# EAGLE design CadenceSense2.0 (EAGLE 7.2.0)
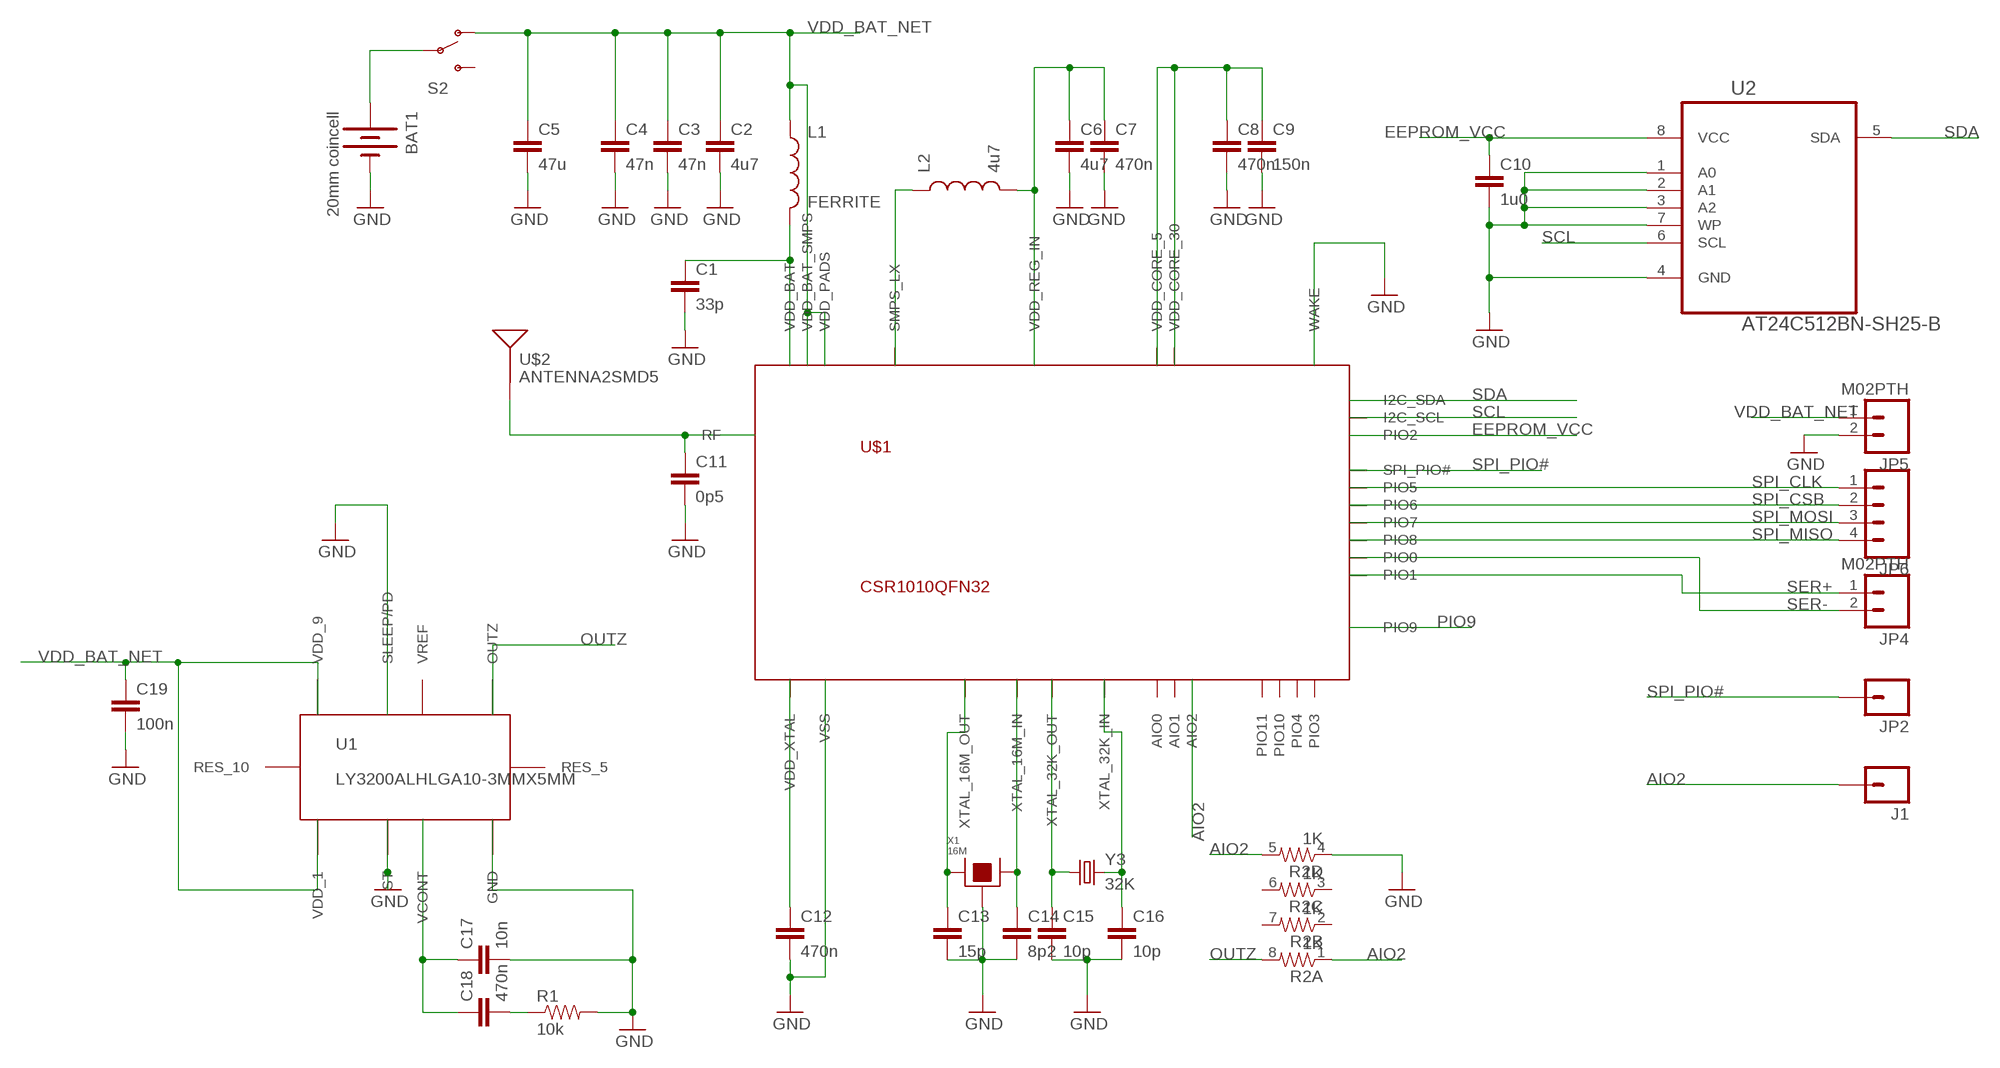
[diagram p0: schematic, sheet 1]

## Parts
BAT1  20mm coincell  BATTERY20MM_4LEGS  [BATTCON_20MM_4LEGS]
C1  33p  CAP0603-CAP  [0603-CAP]
C2  4u7  CAP0603-CAP  [0603-CAP]
C3  47n  CAP0603-CAP  [0603-CAP]
C4  47n  CAP0603-CAP  [0603-CAP]
C5  47u  CAP0603-CAP  [0603-CAP]
C6  4u7  CAP0603-CAP  [0603-CAP]
C7  470n  CAP0603-CAP  [0603-CAP]
C8  470n  CAP0603-CAP  [0603-CAP]
C9  150n  CAP0603-CAP  [0603-CAP]
C10  1u0  CAP0603-CAP  [0603-CAP]
C11  0p5  CAP0603-CAP  [0603-CAP]
C12  470n  CAP0603-CAP  [0603-CAP]
C13  15p  CAP0603-CAP  [0603-CAP]
C14  8p2  CAP0603-CAP  [0603-CAP]
C15  10p  CAP0603-CAP  [0603-CAP]
C16  10p  CAP0603-CAP  [0603-CAP]
C17  10n  CAP0603-CAP  [0603-CAP]
C18  470n  CAP0603-CAP  [0603-CAP]
C19  100n  CAP0603-CAP  [0603-CAP]
J1  M01PTH  [1X01]
JP2  M01PTH  [1X01]
JP4  M02PTH  [1X02]
JP5  M02PTH  [1X02]
JP6  M04PTH  [1X04]
L1  FERRITE  INDUCTOR0805  [0805]
L2  4u7  INDUCTOR0805  [0805]
R1  10k  RESISTOR0603-RES  [0603-RES]
R2  1K  RESISTOR-ARRAY0603-ARV  [0603-ARV]
S2  SWITCH-SPDTSMD  [AYZ0202]
U1  LY3200ALHLGA10-3MMX5MM  [LGA10]
U2  AT24C512BN-SH25-B  [SOIC127P600X175-8N]
U$1  CSR1010QFN32  [QFN-32]
U$2  ANTENNA2SMD5  [ANTENNA-CHIP5]
X1  16M  SHIELDED_CRYSTAL_TSX-3225  [TSX-3225]
Y3  32K  CRYSTALEPSONMC146  [CRYSTAL-32KHZ-SMD_EPSON_MC146]

## Nets
AIO2: J1.1 R2.1 R2.5 U$1.11(AIO2)
EEPROM_VCC: C10.1 U2.8(VCC) U$1.27(PIO2)
GND: BAT1.2(-) C1.2 C2.2 C3.2 C4.2 C5.2 C6.2 C7.2 C8.2 C9.2 C10.2 C11.2 C12.2 C13.2 C14.2 C15.2 C16.2 C17.2 C19.2 JP5.2 R1.2 R2.4 U1.2(ST) U1.4(GND) U1.8(SLEEP/PD) U2.1(A0) U2.2(A1) U2.3(A2) U2.4(GND) U2.7(WP) U$1.4(WAKE) U$1.EP(VSS) X1.2 X1.4
N$1: BAT1.1(+) S2.2(P)
N$2: C6.1 C7.1 L2.2 U$1.6(VDD_REG_IN)
N$3: C1.1 L1.2 U$1.1(VDD_BAT)
N$4: C11.1 U$1.7(RF) U$2.FEED(SIGNAL)
N$5: C16.1 U$1.3(XTAL_32K_IN) Y3.P$1
N$6: L2.1 U$1.31(SMPS_LX)
N$7: C8.1 C9.1 U$1.5(VDD_CORE_5) U$1.30(VDD_CORE_30)
N$8: C15.1 U$1.2(XTAL_32K_OUT) Y3.P$2
N$9: C14.1 U$1.10(XTAL_16M_IN) X1.3
N$12: C13.1 U$1.9(XTAL_16M_OUT) X1.1
N$13: C12.1 U$1.8(VDD_XTAL)
N$15: C17.1 C18.1 U1.3(VCONT)
N$16: C18.2 R1.1
OUTZ: R2.8 U1.6(OUTZ)
PIO9: U$1.23(PIO9)
SCL: U2.6(SCL) U$1.28(I2C_SCL)
SDA: U2.5(SDA) U$1.29(I2C_SDA)
SER+: JP4.1 U$1.15(PIO1)
SER-: JP4.2 U$1.14(PIO0)
SPI_CLK: JP6.1 U$1.18(PIO5)
SPI_CSB: JP6.2 U$1.19(PIO6)
SPI_MISO: JP6.4 U$1.22(PIO8)
SPI_MOSI: JP6.3 U$1.20(PIO7)
SPI_PIO#: JP2.1 U$1.26(SPI_PIO#)
VDD_BAT_NET: C2.1 C3.1 C4.1 C5.1 C19.1 JP5.1 L1.1 S2.1(O) U1.1(VDD_1) U1.9(VDD_9) U$1.21(VDD_PADS) U$1.32(VDD_BAT_SMPS)
Unconnected: R2.2 R2.3 R2.6 R2.7 S2.3(S) U1.5(RES_5) U1.7(VREF) U1.10(RES_10) U$1.12(AIO1) U$1.13(AIO0) U$1.16(PIO3) U$1.17(PIO4) U$1.24(PIO10) U$1.25(PIO11)

## Library data of the parts
BAT1 = SparkFun-Electromechanical:BATTERY: Battery Holders Various common sizes : AA, AAA, 18650 (PRT-12895), 20mm coin cell and 12mm coin cell. 20MM_4LEGS, BATT-10373; PROD_ID: BATT-10373
C1-C19 = SparkFun-Passives:CAP: Capacitor Standard 0603 ceramic capacitor, and 0.1" leaded capacitor.
J1 JP2 = SparkFun-Connectors:M01: Header 1 Standard 1-pin 0.1" header. Use with straight break away headers (SKU : PRT-00116), right angle break away headers (PRT-00553), swiss pins (PRT-00743), machine pins (PRT-00117), and female headers (PRT-00115). SMTSO-256-ET is a "flush mount" nut for a 4-40 screw. The older package used to be too tight, and did not allow it to sit properly thru the drill hit. The latest (0.165DIA) fits nice and snug.
JP4 JP5 = SparkFun-Connectors:M02: Standard 2-pin 0.1" header. Use with - straight break away headers ( PRT-00116) - right angle break away headers (PRT-00553) - swiss pins (PRT-00743) - machine pins (PRT-00117) - female headers (PRT-00115) Molex polarized connector foot print use with: PRT-08233 with associated crimp pins and housings. 2.54_SCREWTERM for use with PRT-10571. 3.5mm Screw Terminal footprints for PRT-08084 5mm Screw Terminal footprints for use with PRT-08432
JP6 = SparkFun-Connectors:M04: Header 4 Standard 4-pin 0.1" header. Use with straight break away headers (SKU : PRT-00116), right angle break away headers (PRT-00553), swiss pins (PRT-00743), machine pins (PRT-00117), and female headers (PRT-00115). Molex polarized connector foot print use with SKU : PRT-08231 with associated crimp pins and housings. 1MM SMD Version SKU: PRT-10208
L1 L2 = SparkFun-Passives:INDUCTOR: Inductors Basic Inductor/Choke - 0603 and 1206. Footprints are not proven and vary greatly between part numbers. SRN6045- 33uH, 20% 1.4A SDR0403-560KL - 56uH, 10%, 500mA RMS/740mA peak
R1 = SparkFun-Passives:RESISTOR: Resistor Basic schematic elements and footprints for 0603, 1206, and PTH resistors.
R2 = SparkFun-Passives:RESISTOR-ARRAY: Array Chip Resistor Source: RS Component / Phycomp
S2 = SparkFun-Electromechanical:SWITCH-SPDT: SPDT Switch Simple slide switch, Spark Fun Electronics SKU : COM-00102 DPDT SMT slide switch, AYZ0202, SWCH-08179; PROD_ID: SWCH-08179; SF_ID: COM-00597
U1 = Ilan:LY3200ALH: LY3200ALH - http://media.digikey.com/pdf/Data%20Sheets/ST%20Microelectronics%20PDFS/LY3200ALH.pdf
U2 = Atmel_By_element14_Batch_1-00:AT24C512BN-SH25-B: Two-wire Serial EEPROM; MPN: AT24C512BN-SH25-B; OC_FARNELL: 1362656; OC_NEWARK: 50M3328; PACKAGE: SOIC-8; SUPPLIER: Atmel
U$1 = Ilan:CSR1010
U$2 = SparkFun-RF:ANTENNA2: Chip antenna Single endded antenna. Common with smaller chip antennas. CHIP4 package is the GPS Chip Antenna SKU: GPS-08418. CHIP5 package is 2.4GHz chip antenna SKU: WRL-00144.
X1 = PP_FreqCtrl:SHIELDED_CRYSTAL
Y3 = SparkFun-FreqCtrl:CRYSTAL: Various standard crystals. Proven footprints.

## Board
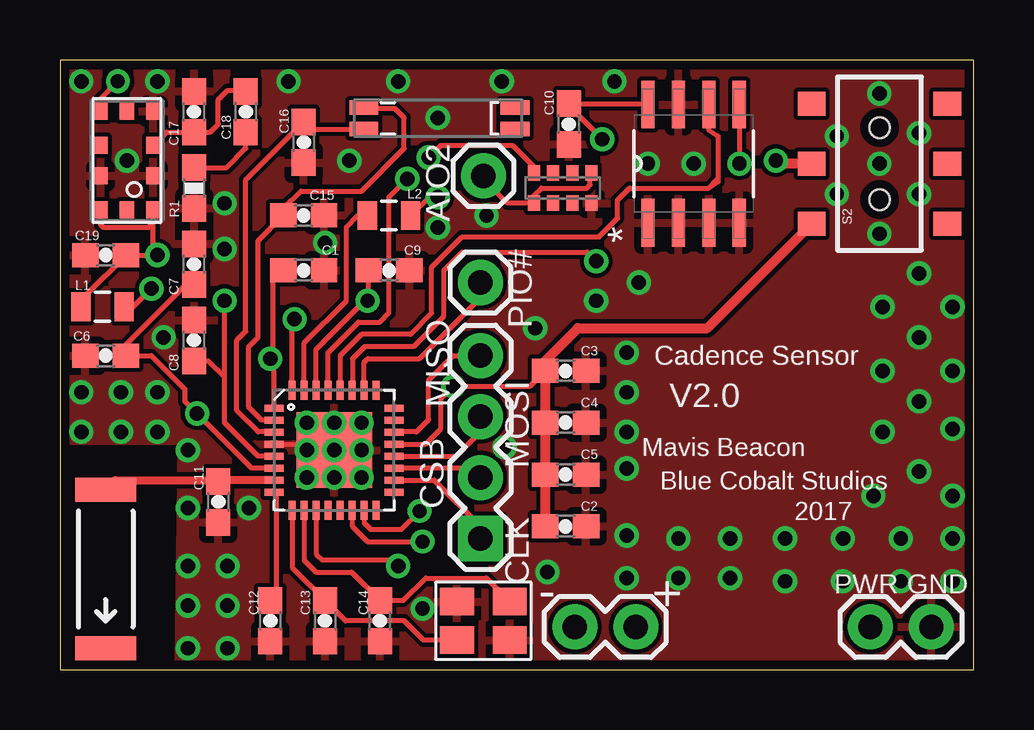
[diagram p1: board, top side]
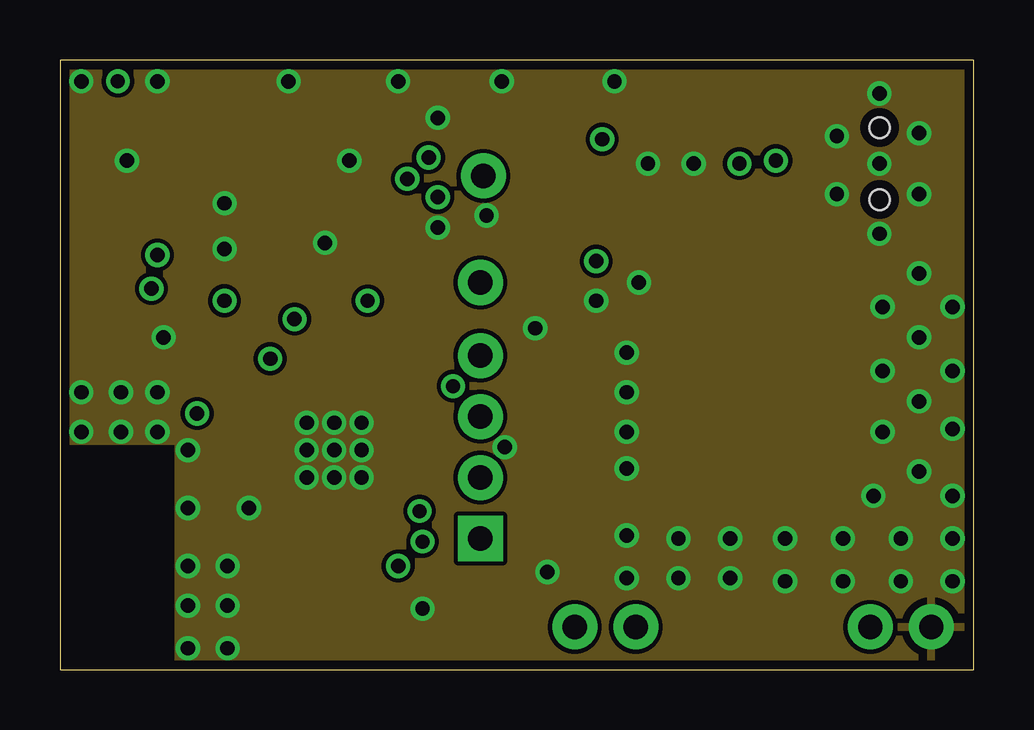
[diagram p2: board, inner layer Route2]
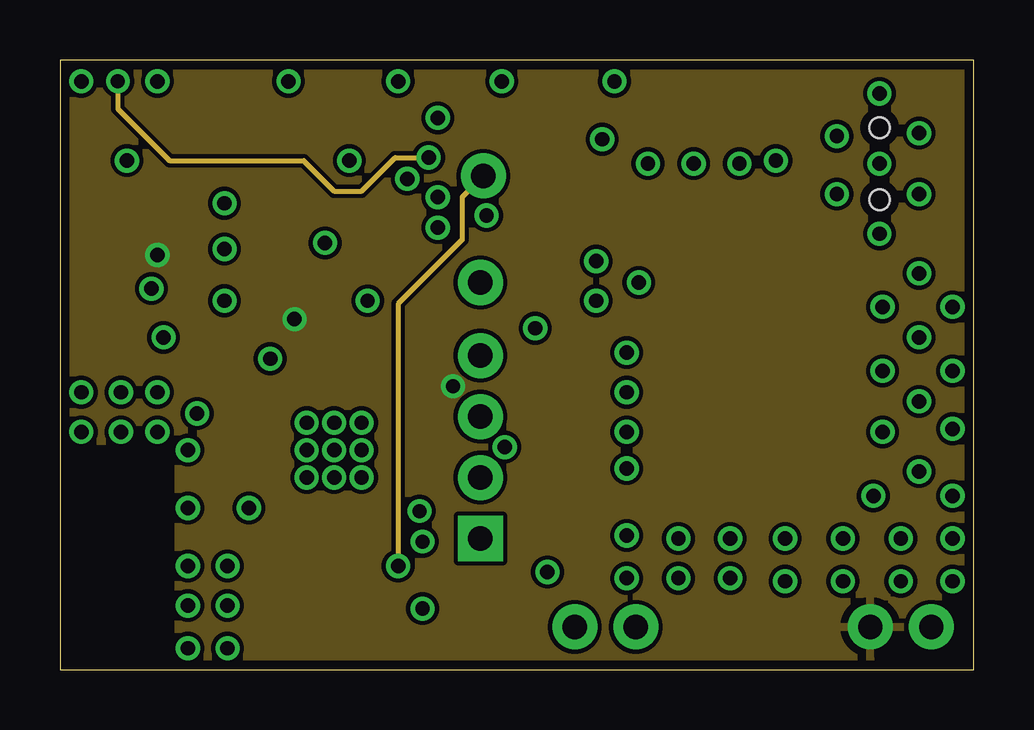
[diagram p3: board, inner layer Route15]
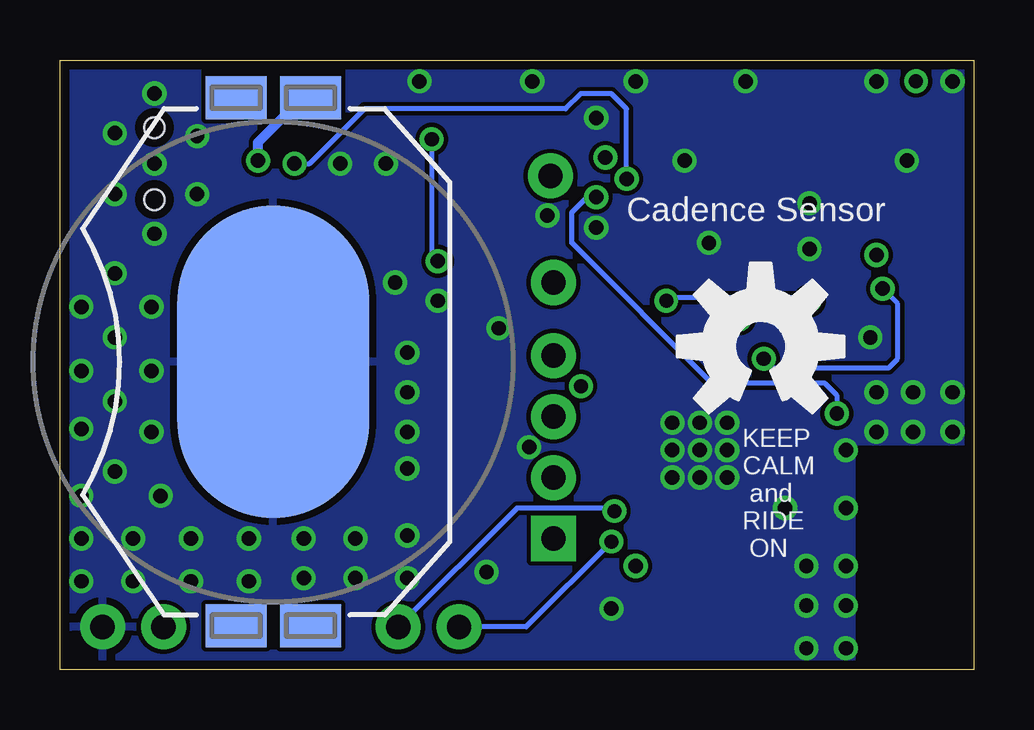
[diagram p4: board, bottom side, seen from below]

Size 38.1 x 25.4 mm. Coordinates in mm from the lower left corner, seen from the top.
Outline: 0,0 38.1,0 38.1,25.4 0,25.4 0,0
Copper layers (1*2*15*16): Top 0.035559375mm / dielectric 0.17018125mm / Route2 0.01778125mm / dielectric 47mil / Route15 0.01778125mm / dielectric 0.17018125mm / Bottom 0.035559375mm
Design rules "Ilan-4layer-cadence *": minimum track width 8mil, minimum drill 10mil, track to track 7mil, track to pad 7mil, pad to pad 7mil, via to via 7mil, smd to smd 6mil, copper to edge 15mil, drill to drill 6mil, minimum pad ring 8mil, minimum via ring 8mil, stop-mask expansion 4mil, vias tented up to drill 25mil, thermal gap 12mil

### Footprints (pad centres in the part's own frame; a part is rotated, then mirrored left to right if it is on the bottom)
BATTCON_20MM_4LEGS = smd 1.778 x 2.54: 1 -11,1.55; 3 11,1.55; P$1 -11,-1.55; P$2 11,-1.55 | smd 13 x 8: 2 0,0
0603-CAP = smd 1.1 x 1: 1 -0.85,0; 2 0.85,0
1X01 = drill 1.016 pad 1.88: 1 0,0
1X02 = drill 1.016 pad 1.88: 1 0,0; 2 2.54,0
1X04 = drill 1.016 pad 1.88 square: 1 0,0 | drill 1.016 pad 1.88: 2 2.54,0; 3 5.08,0; 4 7.62,0
0805 = smd 0.8 x 1.2: 1 -0.9,0; 2 0.9,0
0603-RES = smd 1.1 x 1: 1 -0.85,0; 2 0.85,0
0603-ARV = smd 0.5 x 0.65: 1 -1.2,-0.625; 2 -0.4,-0.625; 3 0.4,-0.625; 4 1.2,-0.625; 5 1.2,0.625; 6 0.4,0.625; 7 -0.4,0.625; 8 -1.2,0.625
AYZ0202 = smd 1 x 1.15: 1 -2.5,2.825; 2 0,2.825; 3 2.5,2.825; 4 -2.5,-2.825; 5 0,-2.825; 6 2.5,-2.825 | hole 0.85: 1.5,0; -1.5,0
LGA10 = smd 0.7 x 0.6: 1 2.05,1.1; 2 0.635,1.1; 3 -0.635,1.1; 4 -2.05,1.1; 5 -2.05,0; 6 -2.05,-1.1; 7 -0.635,-1.1; 8 0.635,-1.1; 9 2.05,-1.1; 10 2.05,0
SOIC127P600X175-8N = smd 1.981 x 0.559: 1 -2.464,1.905; 2 -2.464,0.635; 3 -2.464,-0.635; 4 -2.464,-1.905; 5 2.464,-1.905; 6 2.464,-0.635; 7 2.464,0.635; 8 2.464,1.905
QFN-32 = smd 0.285 x 0.8: 1 -1.75,-2.5; 2 -1.25,-2.5; 3 -0.75,-2.5; 4 -0.25,-2.5; 5 0.25,-2.5; 6 0.75,-2.5; 7 1.25,-2.5; 8 1.75,-2.5; 17 1.75,2.5; 18 1.25,2.5; 19 0.75,2.5; 20 0.25,2.5; 21 -0.25,2.5; 22 -0.75,2.5; 23 -1.25,2.5; 24 -1.75,2.5 | smd 0.8 x 0.285: 9 2.5,-1.75; 10 2.5,-1.25; 11 2.5,-0.75; 12 2.5,-0.25; 13 2.5,0.25; 14 2.5,0.75; 15 2.5,1.25; 16 2.5,1.75; 25 -2.5,1.75; 26 -2.5,1.25; 27 -2.5,0.75; 28 -2.5,0.25; 29 -2.5,-0.25; 30 -2.5,-0.75; 31 -2.5,-1.25; 32 -2.5,-1.75 | smd 3.15 x 3.15: EP 0,0
ANTENNA-CHIP5 = smd 1.016 x 2.54: FEED -3.302,0; NC 3.302,0
TSX-3225 = smd 1.4 x 1.15: 1 -1.1,-0.8; 2 1.1,-0.8; 3 1.1,0.8; 4 -1.1,0.8
CRYSTAL-32KHZ-SMD_EPSON_MC146 = smd 1.2 x 0.6: NC1 6.9,1.2; NC2 6.9,0.3; P$1 0.6,0.3; P$2 0.6,1.2

### Placement (x,y rotation side)
BAT1  29.21,12.83 270 bottom
C1  10.16,16.64 0 top
C2  21.08,5.97 0 top
C3  21.08,12.45 0 top
C4  21.08,10.29 0 top
C5  21.08,8.13 0 top
C6  1.91,13.08 180 top
C7  5.59,16.89 90 top
C8  5.59,13.72 90 top
C9  13.72,16.64 0 top
C10  21.21,22.73 270 top
C11  6.6,6.99 270 top
C12  8.76,2.03 270 top
C13  11.05,2.03 270 top
C14  13.34,2.03 270 top
C15  10.16,18.92 0 top
C16  10.16,21.97 270 top
C17  5.59,23.24 90 top
C18  7.75,23.24 270 top
C19  1.91,17.27 180 top
J1  17.65,20.57 0 top
JP2  17.53,16.13 270 top
JP4  24,1.78 180 top
JP5  33.78,1.78 0 top
JP6  17.53,5.46 90 top
L1  1.78,15.11 0 top
L2  13.72,18.92 0 top
R1  5.59,20.07 270 top
R2  20.95,20.07 0 top
S2  34.16,21.08 90 top
U1  2.79,21.21 270 top
U2  26.42,21.08 90 top
U$1  11.43,9.14 270 top
U$2  1.91,4.19 270 top
U$3  [OSHW-LOGO-L]  8.89,13.46 0 bottom
X1  17.65,2.03 0 top
Y3  12.06,22.23 0 top

### Tracks (layer width: path | path; a pad name or v marks a point on that pad's centre or on a via)
AIO2  (via drill 0.6 pad 0.3)
  Top 0.203: U$1.11 10.68,4.81 10.92,4.57 13.84,4.57 v14.1,4.32 | R2.5 22.1,20.63 22.1,20.19 21.97,20.07 20.07,20.07 19.75,19.75 R2.1 18.66,19.44 17.65,20.45 J1.1
  Route15 0.203: J1.1 16.76,19.68 16.76,17.91 14.1,15.24 v14.1,4.32
EEPROM_VCC  (via drill 0.6, 0.6 pad 0.3)
  Top 0.203: U$1.27 12.19,11.66 12.19,12.95 12.7,13.46 14.73,13.46 16,14.73 16,16.64 16.76,17.4 21.97,17.4 v22.35,17.02 | U2.8 24.47,23.58 C10.1 21.21,23.5 v22.61,22.1
  Bottom 0.203: v22.61,22.1 22.61,17.27 v22.35,17.02
GND  (via drill 0.6 pad 0.25, 0.6 pad 0.3)
  Top 0.203: U$1.4 10.04,9.39 v10.29,9.14
  other vias: 11.43,9.14 10.29,10.29 10.29,8 12.57,8 12.57,10.29 0.89,9.91 2.54,9.91 4.06,9.91 5.33,9.14 5.33,2.67 5.33,0.89 6.99,2.67 0.89,11.56 2.54,11.56 4.06,11.56 5.33,4.32 6.99,4.32 6.99,0.89 37.21,5.46 2.79,21.21 22.35,15.37 18.41,24.51 7.87,6.73 5.33,6.73 14.1,24.51 37.21,3.68 0.89,24.51 30.23,5.46 4.06,24.51 9.53,24.51 6.86,17.53 6.86,19.43 4.32,13.84 11.05,17.78 18.54,9.27 15.75,18.41 15.75,22.99 12.06,21.21 15.11,2.54 19.81,14.22 35.05,3.68 35.05,5.46 32.64,3.68 32.64,5.46 30.23,3.68 27.94,5.46 25.78,5.46 23.62,3.81 25.78,3.81 27.94,3.81 20.32,4.06 11.43,8 12.57,9.14 11.43,10.29 24.51,21.08 26.42,21.08 37.21,7.24 37.21,10.03 37.21,12.45 37.21,15.11 23.62,8.38 23.62,9.91 24.13,16.13 23.62,11.56 33.91,7.24 34.29,15.11 34.16,18.16 34.16,21.08 34.16,24 35.81,16.51 35.81,13.84 32.38,19.81 32.38,22.23 35.81,19.81 35.81,22.35 23.11,24.51 17.78,18.92 23.62,13.21 23.62,5.59 34.29,12.45 34.29,9.91 35.81,11.18 35.81,8.26
  pour Bottom: 0,25.4 38.1,25.4 38.1,25.27 38.1,0 5.08,0 5.08,9.53 0,9.53 0,9.65
  pour Top: 4.95,0 5.08,9.53 0,9.53 0,25.4 38.1,25.4 38.1,0
  pour Route2: 0,25.4 38.1,25.4 38.1,25.15 38.1,0 4.95,0 4.95,9.53 0,9.53 0,9.65
N$1  (via drill 0.6)
  Top 0.406: S2.2 29.84,21.08 v29.84,21.21
  Bottom 0.406: v29.84,21.21 29.84,21.97 28.19,23.62 27.86,23.62 BAT1.1
N$2  (via drill 0.6 pad 0.3)
  Top 0.203: U$1.6 7.99,8.39 v5.71,10.67 5.21,11.18 5.21,11.68 3.81,13.08 C6.1 | 5.8,16.04 C7.1 5.25,16.04 2.75,13.55 C6.1 | 2.79,13.12 C6.1 | L2.2 15.38,19.68 v15.75,19.68
  Bottom 0.203: v5.71,10.67 5.71,11.43 6.22,11.94 10.92,11.94 16.76,17.78 16.76,19.05 16.13,19.68 v15.75,19.68
N$3  (via drill 0.6 pad 0.3)
  Top 0.203: U$1.1 8.93,12.79 v8.76,12.95 8.89,13.08 8.89,16.22 C1.1 | L1.2 3.05,15.11 v3.81,15.88
  Bottom 0.203: v8.76,12.95 8.38,12.57 3.56,12.57 3.17,12.95 3.17,15.24 v3.81,15.88
N$4
  Top 0.33: U$1.7 6.54,7.89 C11.1 6.54,7.89 2.31,7.89 U$2.FEED
N$5
  Top 0.203: U$1.3 8.92,9.91 8.26,9.91 7.37,10.79 7.37,13.72 7.75,14.1 7.75,20.41 C16.1 10.46,22.52 Y3.P$1
N$6
  Top 0.203: L2.1 12.44,18.92 11.94,18.43 11.94,15.37 10.18,13.61 U$1.31
N$7  (via drill 0.58 pad 0.3, 0.6 pad 0.3)
  Top 0.203: U$1.5 8.25,8.89 6.86,10.29 6.86,12.19 | 6.86,12.19 v6.86,15.37 | C8.1 6.18,12.87 6.86,12.19 | 12.7,16.47 C9.1 12.87,15.41 v12.83,15.37 12.7,15.37 10.68,13.35 U$1.30
  Bottom 0.203: v6.86,15.37 6.99,15.49 12.7,15.49 v12.83,15.37
N$8
  Top 0.203: U$1.2 8.4,10.39 7.87,10.92 7.87,13.46 8.26,13.84 8.26,17.87 C15.1 9.31,19.22 10.03,19.94 12.57,19.94 14.35,21.72 14.35,22.99 13.97,23.37 12.72,23.37 Y3.P$2 13.1,23.37
N$9
  Top 0.203: 10.16,6.62 U$1.10 10.18,4.55 10.67,4.06 12.15,4.06 C14.1 14.31,2.88 15.24,3.81 17.77,3.81 X1.3
N$12
  Top 0.203: U$1.9 9.68,4.25 C13.1 11.9,2.03 14.35,2.03 15.15,1.23 X1.1
N$13
  Top 0.203: U$1.8 9.02,7.31 9.02,3.14 C12.1
N$15
  Top 0.203: U1.3 4.44,22.39 C17.1 6.26,22.39 6.6,22.73 6.6,23.75 6.99,24.13 7.71,24.13 C18.1
N$16
  Top 0.203: R1.1 6.95,20.92 7.75,21.72 C18.2
OUTZ  (via drill 0.58 pad 0.3, 0.6)
  Top 0.203: U1.6 1.69,23.79 v2.41,24.51 | v15.37,21.34 15.88,21.84 18.86,21.84 19.75,20.95 R2.8
  Route15 0.203: v2.41,24.51 2.41,23.37 4.57,21.21 10.16,21.21 11.43,19.94 12.57,19.94 13.97,21.34 v15.37,21.34
SCL
  Top 0.203: U2.6 27.05,22.48 27.43,22.23 27.43,20.45 | 27.43,20.45 27.43,20.32 27.05,20.07 | 27.05,20.07 23.75,20.07 23.24,19.56 23.24,18.8 22.48,18.03 16.76,18.03 15.49,16.76 15.49,14.86 14.61,13.97 12.57,13.97 11.68,13.08 U$1.28 | 27.05,20.07 27.43,20.45
SDA  (via drill 0.6)
  Top 0.203: U$1.29 11.18,13.21 12.45,14.48 13.34,14.48 13.72,14.86 13.72,19.68 v14.48,20.45 | U2.5 v28.32,21.08
  Bottom 0.203: v14.48,20.45 14.48,23.37 15.11,24 16.38,24 17.02,23.37 25.4,23.37 27.69,21.08 v28.32,21.08
SER+  (via drill 0.58 pad 0.3)
  Top 0.203: U$1.15 12.68,6.12 12.95,5.84 14.22,5.84 v14.99,6.6
  Bottom 0.203: v14.99,6.6 15.11,6.73 19.05,6.73 JP4.1
SER-  (via drill 0.58 pad 0.3)
  Top 0.203: U$1.14 12.18,5.98 12.83,5.33 v15.11,5.33
  Bottom 0.203: v15.11,5.33 18.67,1.78 JP4.2
SPI_CLK
  Top 0.203: U$1.18 15.6,7.89 17.53,5.97 JP6.1
SPI_CSB
  Top 0.203: JP6.2 17.14,8.38 13.94,8.38 U$1.19
SPI_MISO
  Top 0.203: U$1.22 13.94,9.91 14.86,9.91 15.37,10.41 15.37,12.06 16.38,13.08 JP6.4
SPI_MOSI
  Top 0.203: U$1.20 16.51,8.89 17.53,9.91 JP6.3
SPI_PIO#
  Top 0.203: JP2.1 17.53,15.49 14.99,12.95 12.83,12.95 12.68,12.81 U$1.26
VDD_BAT_NET  (via drill 0.58 pad 0.3, 0.6 pad 0.3)
  Top 0.203: L1.1 0.88,15.61 1.09,15.61 C19.1 v4.06,17.27 4.02,17.32 | U$1.21 15.24,9.39 15.88,10.03 15.88,11.3 v16.38,11.81 19.6,11.81 C3.1 | U1.9 1.69,18.54 1.82,18.41 3.68,18.41 3.89,18.63 U1.1 3.89,17.32 | U$1.32 9.68,14.51 v9.78,14.61
  Top 0.305: 3.89,17.32 4.02,17.32
  Top 0.406: C2.1 C5.1 C4.1 C3.1 20.23,12.87 21.59,14.22 26.98,14.22 S2.1
  pour Route15: 37.97,25.27 38.1,25.27 38.1,0
  pour Route15: 0,25.4 38.1,25.4 38.1,24.64 38.1,0 4.95,0 4.95,0.38 4.95,9.53 0,9.53 0,9.65

### Text on the board
tPlace: AIO2 | PIO# | Cadence Sensor | MISO | V2.0 | CSB | Mavis Beacon | MOSI | Blue Cobalt Studios | 2017 | CLK | - | + | PWR | GND
bPlace: Cadence Sensor | KEEP / CALM / and / RIDE / ON